# Altium schematic sheet Digital_Watch.SchDoc
size A4; Revision: 1.0; SheetNumber: 1; SheetTotal: 9; DocumentSize: A4; RefLayoutTitle: Digital Watch
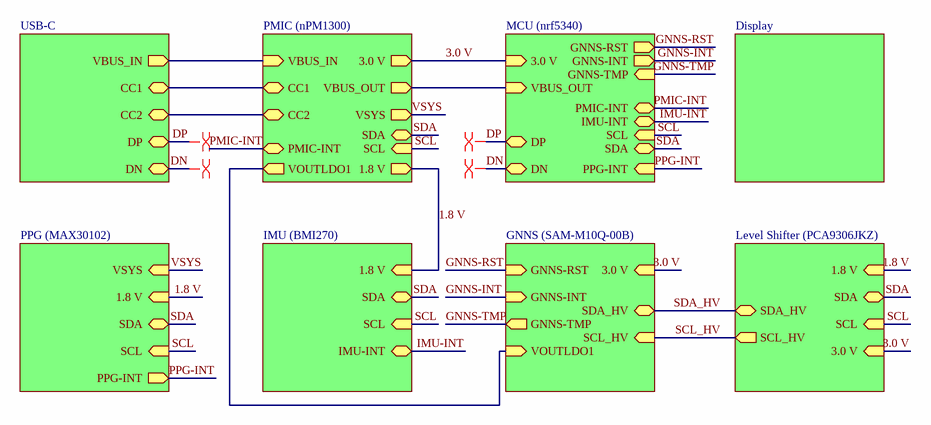
[diagram p0: Digital_Watch.SchDoc]

## Sub-sheets
Designator = MCU (nrf5340): 3.0 V (in), DP (bidir), DN (bidir), VBUS_OUT (in), GNNS-RST (out), GNNS-INT (out), GNNS-TMP (in), PPG-INT (in), SDA (bidir), SCL (in), IMU-INT (bidir), PMIC-INT (bidir)
Designator = PMIC (nPM1300): 3.0 V (out), VBUS_IN (in), CC1 (bidir), CC2 (bidir), VBUS_OUT (out), VSYS (out), VOUTLDO1 (out), 1.8 V (out), SCL (in), SDA (bidir), PMIC-INT (bidir)
Designator = USB-C: DN (bidir), DP (bidir), CC2 (bidir), CC1 (bidir), VBUS_IN (out)
Designator = IMU (BMI270): 1.8 V (in), SDA (bidir), SCL (in), IMU-INT (bidir)
Designator = GNNS (SAM-M10Q-00B): 3.0 V (in), GNNS-RST (in), GNNS-INT (in), GNNS-TMP (out), VOUTLDO1 (in), SDA_HV (bidir), SCL_HV (in)
Designator = PPG (MAX30102): VSYS (in), SCL (in), 1.8 V (in), SDA (bidir), PPG-INT (out)
Designator = Level Shifter (PCA9306JKZ): 1.8 V (in), 3.0 V (in), SCL_HV (out), SDA_HV (bidir), SDA (bidir), SCL (in)
Designator = Display: no entries

## Nets
1.8 V: sheet Designator/1.8 V, sheet Designator/1.8 V, sheet Designator/1.8 V, sheet Designator/1.8 V
3.0 V: sheet Designator/3.0 V, sheet Designator/3.0 V, sheet Designator/3.0 V, sheet Designator/3.0 V
DN: sheet Designator/DN, sheet Designator/DN
DP: sheet Designator/DP, sheet Designator/DP
GNNS-INT: sheet Designator/GNNS-INT, sheet Designator/GNNS-INT
GNNS-RST: sheet Designator/GNNS-RST, sheet Designator/GNNS-RST
GNNS-TMP: sheet Designator/GNNS-TMP, sheet Designator/GNNS-TMP
IMU-INT: sheet Designator/IMU-INT, sheet Designator/IMU-INT
PMIC-INT: sheet Designator/PMIC-INT, sheet Designator/PMIC-INT
PPG-INT: sheet Designator/PPG-INT, sheet Designator/PPG-INT
SCL: sheet Designator/SCL, sheet Designator/SCL, sheet Designator/SCL, sheet Designator/SCL, sheet Designator/SCL
SCL_HV: sheet Designator/SCL_HV, sheet Designator/SCL_HV
SDA: sheet Designator/SDA, sheet Designator/SDA, sheet Designator/SDA, sheet Designator/SDA, sheet Designator/SDA
SDA_HV: sheet Designator/SDA_HV, sheet Designator/SDA_HV
VSYS: sheet Designator/VSYS, sheet Designator/VSYS
(unnamed): sheet Designator/VBUS_OUT, sheet Designator/VBUS_OUT
(unnamed): sheet Designator/VBUS_IN, sheet Designator/VBUS_IN
(unnamed): sheet Designator/CC1, sheet Designator/CC1
(unnamed): sheet Designator/CC2, sheet Designator/CC2
(unnamed): sheet Designator/VOUTLDO1, sheet Designator/VOUTLDO1

## Layout directives
differential pair: DN, DP

## Notes on the sheet
- Title
- Size
- Date:
- A4
- Device
- Sheet         of
- Revision
- File:
- Drawn By: